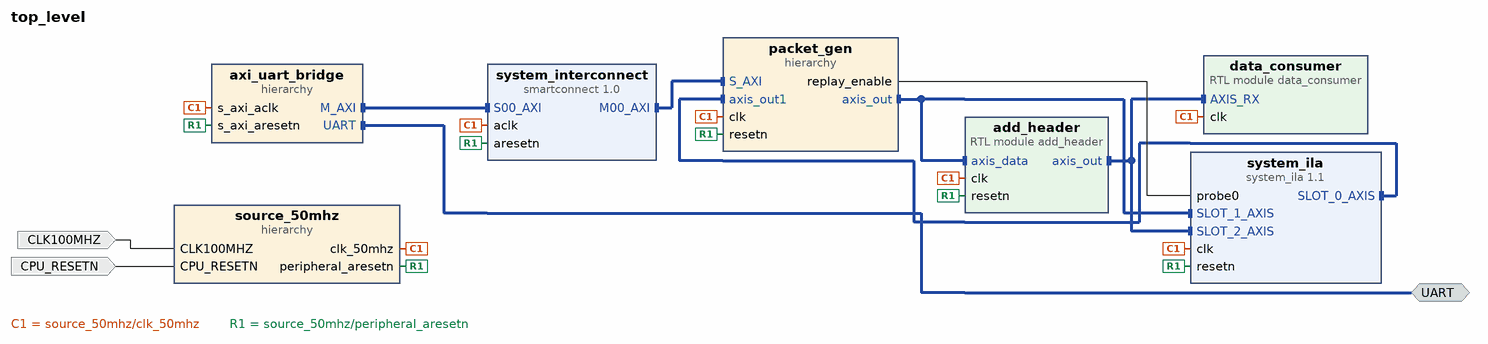
[diagram p0: block diagram of the top level]
# Vivado block design top_level, xc7a100tcsg324-1, Vivado 2021.1
create_bd_design top_level

create_bd_intf_port -mode Master -vlnv xilinx.com:interface:uart_rtl:1.0 UART
create_bd_port -dir I -type clk CLK100MHZ
create_bd_port -dir I -type rst CPU_RESETN

create_bd_cell -type hier source_50mhz
create_bd_cell -type module -reference data_consumer data_consumer
set_property -dict {CONFIG.DW 128} [get_bd_cells data_consumer]
create_bd_cell -type ip -vlnv xilinx.com:ip:system_ila:1.1 system_ila
set_property -dict [list \
  CONFIG.C_MON_TYPE MIX \
  CONFIG.C_NUM_MONITOR_SLOTS 3 \
  CONFIG.C_SLOT 2 \
  CONFIG.C_SLOT_0_INTF_TYPE xilinx.com:interface:axis_rtl:1.0 \
  CONFIG.C_SLOT_1_INTF_TYPE xilinx.com:interface:axis_rtl:1.0 \
  CONFIG.C_SLOT_2_INTF_TYPE xilinx.com:interface:axis_rtl:1.0 \
  CONFIG.C_SLOT_3_INTF_TYPE xilinx.com:interface:axis_rtl:1.0 \
] [get_bd_cells system_ila]
create_bd_cell -type ip -vlnv xilinx.com:ip:smartconnect:1.0 system_interconnect
set_property -dict {CONFIG.NUM_SI 1} [get_bd_cells system_interconnect]
create_bd_cell -type hier axi_uart_bridge
create_bd_cell -type hier packet_gen
create_bd_cell -type module -reference add_header add_header
set_property -dict {CONFIG.FIFO_DEPTH 8192} [get_bd_cells add_header]

# ---- hierarchy /source_50mhz ----
current_bd_instance /source_50mhz
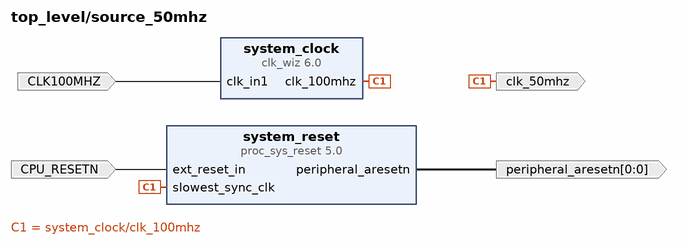
[diagram p1: block diagram inside /source_50mhz]
create_bd_pin -dir I -type clk CLK100MHZ
create_bd_pin -dir I -type rst CPU_RESETN
create_bd_pin -dir O -from 0 -to 0 peripheral_aresetn
create_bd_pin -dir O clk_50mhz

create_bd_cell -type ip -vlnv xilinx.com:ip:clk_wiz:6.0 system_clock
set_property -dict [list \
  CONFIG.CLKOUT1_JITTER 151.636 \
  CONFIG.CLKOUT1_REQUESTED_OUT_FREQ 50 \
  CONFIG.CLK_OUT1_PORT clk_100mhz \
  CONFIG.MMCM_CLKOUT0_DIVIDE_F 20.000 \
  CONFIG.USE_LOCKED false \
  CONFIG.USE_RESET false \
] [get_bd_cells system_clock]
create_bd_cell -type ip -vlnv xilinx.com:ip:proc_sys_reset:5.0 system_reset

# ---- hierarchy /axi_uart_bridge ----
current_bd_instance /axi_uart_bridge
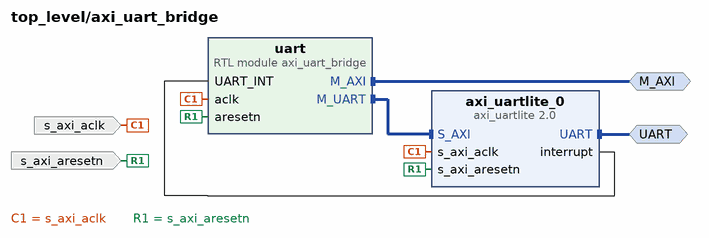
[diagram p2: block diagram inside /axi_uart_bridge]
create_bd_intf_pin -mode Master -vlnv xilinx.com:interface:aximm_rtl:1.0 M_AXI
create_bd_intf_pin -mode Master -vlnv xilinx.com:interface:uart_rtl:1.0 UART
create_bd_pin -dir I -type clk s_axi_aclk
create_bd_pin -dir I -type rst s_axi_aresetn

create_bd_cell -type ip -vlnv xilinx.com:ip:axi_uartlite:2.0 axi_uartlite_0
set_property -dict {CONFIG.C_BAUDRATE 115200} [get_bd_cells axi_uartlite_0]
create_bd_cell -type module -reference axi_uart_bridge uart
set_property -dict {CONFIG.CLOCK_FREQ 50000000} [get_bd_cells uart]

# ---- hierarchy /packet_gen ----
current_bd_instance /packet_gen
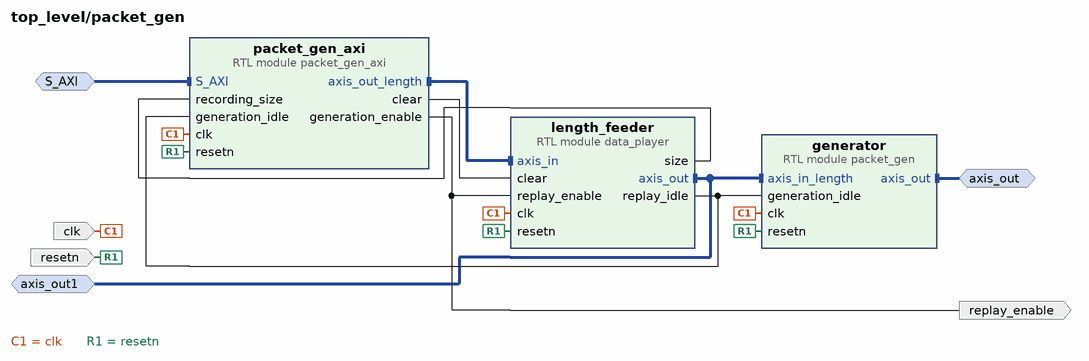
[diagram p3: block diagram inside /packet_gen]
create_bd_intf_pin -mode Slave -vlnv xilinx.com:interface:aximm_rtl:1.0 S_AXI
create_bd_intf_pin -mode Master -vlnv xilinx.com:interface:axis_rtl:1.0 axis_out
create_bd_intf_pin -mode Monitor -vlnv xilinx.com:interface:axis_rtl:1.0 axis_out1
create_bd_pin -dir I -type clk clk
create_bd_pin -dir I -type rst resetn
create_bd_pin -dir O replay_enable

create_bd_cell -type module -reference packet_gen generator
create_bd_cell -type module -reference packet_gen_axi packet_gen_axi
create_bd_cell -type module -reference data_player length_feeder
set_property -dict {CONFIG.CAPACITY 1024} [get_bd_cells length_feeder]

# ---- connections ----

current_bd_instance /source_50mhz
connect_bd_net -net clk_in1_0_1 [get_bd_pins CLK100MHZ] [get_bd_pins system_clock/clk_in1]
connect_bd_net -net ext_reset_in_0_1 [get_bd_pins CPU_RESETN] [get_bd_pins system_reset/ext_reset_in]
connect_bd_net -net proc_sys_reset_0_peripheral_aresetn [get_bd_pins system_reset/peripheral_aresetn] [get_bd_pins peripheral_aresetn]
connect_bd_net [get_bd_pins system_clock/clk_100mhz] [get_bd_pins system_reset/slowest_sync_clk] [get_bd_pins clk_50mhz]

current_bd_instance /axi_uart_bridge
connect_bd_intf_net -intf_net axi_uart_bridge_0_M_AXI [get_bd_intf_pins M_AXI] [get_bd_intf_pins uart/M_AXI]
connect_bd_intf_net -intf_net axi_uart_bridge_0_M_UART [get_bd_intf_pins axi_uartlite_0/S_AXI] [get_bd_intf_pins uart/M_UART]
connect_bd_intf_net [get_bd_intf_pins UART] [get_bd_intf_pins axi_uartlite_0/UART]
connect_bd_net [get_bd_pins axi_uartlite_0/interrupt] [get_bd_pins uart/UART_INT]
connect_bd_net -net source_50mhz_clk_50mhz [get_bd_pins s_axi_aclk] [get_bd_pins axi_uartlite_0/s_axi_aclk] [get_bd_pins uart/aclk]
connect_bd_net -net source_50mhz_peripheral_aresetn [get_bd_pins s_axi_aresetn] [get_bd_pins axi_uartlite_0/s_axi_aresetn] [get_bd_pins uart/aresetn]

current_bd_instance /packet_gen
connect_bd_intf_net [get_bd_intf_pins length_feeder/axis_out] [get_bd_intf_pins generator/axis_in_length]
connect_bd_intf_net [get_bd_intf_pins length_feeder/axis_out] [get_bd_intf_pins axis_out1]
connect_bd_intf_net [get_bd_intf_pins length_feeder/axis_in] [get_bd_intf_pins packet_gen_axi/axis_out_length]
connect_bd_intf_net -intf_net packet_gen_axis_out [get_bd_intf_pins axis_out] [get_bd_intf_pins generator/axis_out]
connect_bd_intf_net -intf_net system_interconnect_M00_AXI [get_bd_intf_pins S_AXI] [get_bd_intf_pins packet_gen_axi/S_AXI]
connect_bd_net -net data_player_0_out_size [get_bd_pins length_feeder/size] [get_bd_pins packet_gen_axi/recording_size]
connect_bd_net [get_bd_pins length_feeder/replay_idle] [get_bd_pins generator/generation_idle] [get_bd_pins packet_gen_axi/generation_idle]
connect_bd_net -net packet_gen_axi_0_clear [get_bd_pins packet_gen_axi/clear] [get_bd_pins length_feeder/clear]
connect_bd_net [get_bd_pins packet_gen_axi/generation_enable] [get_bd_pins replay_enable] [get_bd_pins length_feeder/replay_enable]
connect_bd_net -net source_50mhz_clk_50mhz [get_bd_pins clk] \
  [get_bd_pins generator/clk] [get_bd_pins packet_gen_axi/clk] [get_bd_pins length_feeder/clk]
connect_bd_net -net source_50mhz_peripheral_aresetn [get_bd_pins resetn] \
  [get_bd_pins generator/resetn] [get_bd_pins packet_gen_axi/resetn] [get_bd_pins length_feeder/resetn]

current_bd_instance /
connect_bd_intf_net [get_bd_intf_pins system_ila/SLOT_0_AXIS] [get_bd_intf_pins packet_gen/axis_out1]
connect_bd_intf_net [get_bd_intf_pins add_header/axis_out] [get_bd_intf_pins data_consumer/AXIS_RX]
connect_bd_intf_net [get_bd_intf_pins add_header/axis_out] [get_bd_intf_pins system_ila/SLOT_2_AXIS]
connect_bd_intf_net -intf_net axi_uart_bridge_0_M_AXI [get_bd_intf_pins axi_uart_bridge/M_AXI] [get_bd_intf_pins system_interconnect/S00_AXI]
connect_bd_intf_net -intf_net axi_uartlite_0_UART [get_bd_intf_ports UART] [get_bd_intf_pins axi_uart_bridge/UART]
connect_bd_intf_net [get_bd_intf_pins add_header/axis_data] [get_bd_intf_pins packet_gen/axis_out]
connect_bd_intf_net [get_bd_intf_pins add_header/axis_data] [get_bd_intf_pins system_ila/SLOT_1_AXIS]
connect_bd_intf_net [get_bd_intf_pins packet_gen/S_AXI] [get_bd_intf_pins system_interconnect/M00_AXI]
connect_bd_net -net clk_in1_0_1 [get_bd_ports CLK100MHZ] [get_bd_pins source_50mhz/CLK100MHZ]
connect_bd_net -net ext_reset_in_0_1 [get_bd_ports CPU_RESETN] [get_bd_pins source_50mhz/CPU_RESETN]
connect_bd_net -net packet_gen_axi_0_start_generation [get_bd_pins packet_gen/replay_enable] [get_bd_pins system_ila/probe0]
connect_bd_net [get_bd_pins source_50mhz/clk_50mhz] \
  [get_bd_pins data_consumer/clk] [get_bd_pins system_ila/clk] [get_bd_pins system_interconnect/aclk] \
  [get_bd_pins axi_uart_bridge/s_axi_aclk] [get_bd_pins packet_gen/clk] [get_bd_pins add_header/clk]
connect_bd_net [get_bd_pins source_50mhz/peripheral_aresetn] \
  [get_bd_pins system_ila/resetn] [get_bd_pins system_interconnect/aresetn] [get_bd_pins axi_uart_bridge/s_axi_aresetn] \
  [get_bd_pins packet_gen/resetn] [get_bd_pins add_header/resetn]

# ---- address map ----
assign_bd_address -offset 0x0000000044A00000 -range 64K -target_address_space [get_bd_addr_spaces axi_uart_bridge/uart/M_AXI] [get_bd_addr_segs packet_gen/packet_gen_axi/S_AXI/reg0]
assign_bd_address -offset 0x40600000 -range 64K -target_address_space [get_bd_addr_spaces axi_uart_bridge/uart/M_UART] [get_bd_addr_segs axi_uart_bridge/axi_uartlite_0/S_AXI/Reg]

validate_bd_design
save_bd_design
